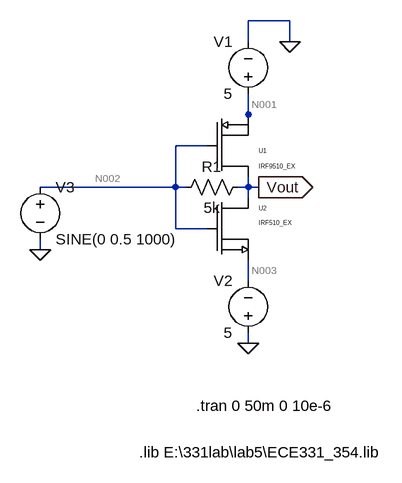
[diagram p0: schematic test.asc]
test.asc, the LTspice schematic file:
Version 4
SHEET 1 880 680
WIRE -32 -720 -96 -720
WIRE -96 -688 -96 -720
WIRE -32 -688 -32 -720
WIRE -96 -576 -96 -608
WIRE -96 -560 -96 -576
WIRE -160 -528 -208 -528
WIRE -208 -464 -208 -528
WIRE -208 -464 -416 -464
WIRE -192 -464 -208 -464
WIRE -96 -464 -96 -480
WIRE -96 -464 -112 -464
WIRE -80 -464 -96 -464
WIRE -96 -448 -96 -464
WIRE -208 -400 -208 -464
WIRE -160 -400 -208 -400
WIRE -416 -368 -416 -384
WIRE -96 -320 -96 -352
WIRE -96 -224 -96 -240
FLAG -32 -688 0
FLAG -96 -224 0
FLAG -80 -464 Vout
IOPIN -80 -464 Out
FLAG -416 -368 0
SYMBOL voltage -96 -592 R180
WINDOW 0 24 96 Left 2
WINDOW 3 24 16 Left 2
WINDOW 123 0 0 Left 2
WINDOW 39 0 0 Left 2
SYMATTR InstName V1
SYMATTR Value 5
SYMBOL IRF9510 -160 -576 R0
SYMATTR InstName U1
SYMBOL IRF510 -160 -448 R0
SYMATTR InstName U2
SYMBOL res -96 -480 R90
WINDOW 0 0 56 VBottom 2
WINDOW 3 32 56 VTop 2
SYMATTR InstName R1
SYMATTR Value 5k
SYMBOL voltage -96 -224 R180
WINDOW 0 24 96 Left 2
WINDOW 3 24 16 Left 2
WINDOW 123 0 0 Left 2
WINDOW 39 0 0 Left 2
SYMATTR InstName V2
SYMATTR Value 5
SYMBOL voltage -416 -480 R0
WINDOW 123 0 0 Left 2
WINDOW 39 0 0 Left 2
SYMATTR InstName V3
SYMATTR Value SINE(0 0.5 1000)
TEXT -176 -128 Left 2 !.tran 0 50m 0 10e-6
TEXT -264 -56 Left 2 !.lib E:\\331lab\\lab5\\ECE331_354.lib

The netlist it stands for:
* test.asc
V1 N001 0 5
XU1 Vout N002 N001 IRF9510_EX  ; pins D G S
XU2 Vout N002 N003 IRF510_EX  ; pins D G S
R1 Vout N002 5k
V2 0 N003 5
V3 N002 0 SINE(0 0.5 1000)
.tran 0 50m 0 10e-6
.lib E:\331lab\lab5\ECE331_354.lib
.backanno
.end

* Results of the author's LTspice run, read from the files saved beside the schematic
* Operating Point, zero values left out:
*   V(n001) = 5 V
*   V(vout) = 3.525 V
*   V(n003) = -5 V
*   I(R1) = 705 µA
*   I(V3) = 705 µA
*   I(V2) = -998.4 mA
*   I(V1) = -999.1 mA
*   Ix(u1:1) = -999.1 mA
*   Ix(u1:3) = 999.1 mA
*   Ix(u2:1) = 998.4 mA
*   Ix(u2:2) = -3.458 pA
*   Ix(u2:3) = -998.4 mA
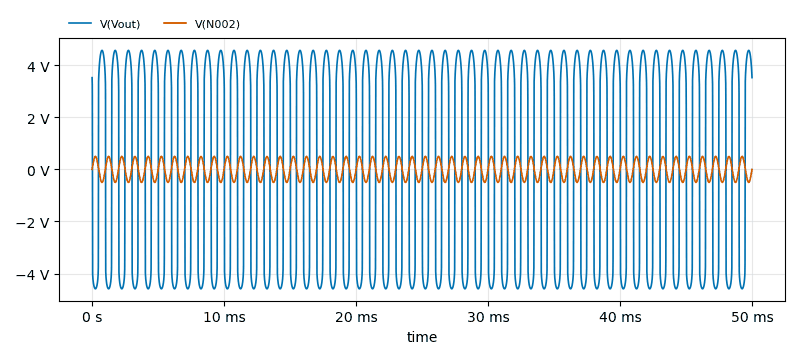
[diagram p1: Transient Analysis of test.asc, plotted from the saved traces]
* Transient Analysis, 1 run:
*   V(Vout): min -4.587 V, max 4.574 V, average 273.1 mV, rms 4.281 V, last 3.526 V
*   V(N002): min -499.5 mV, max 499.5 mV, average 10.31 µV, rms 353 mV, last 0 V